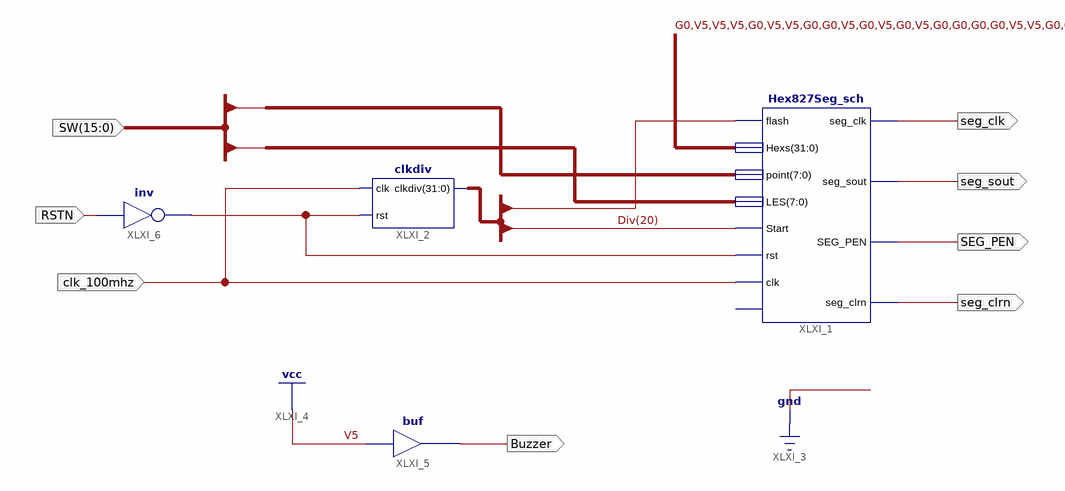
[diagram p0: schematic sheet 1]
// Xilinx ISE schematic Hex827_test.sch (kintex7) as structural Verilog: 4 symbols, 8 ports
module Hex827_test (
  input  clk_100mhz,
  input  RSTN,
  input  [15:0] SW,
  output Buzzer,
  output seg_clk,
  output seg_sout,
  output SEG_PEN,
  output seg_clrn
);

  wire XLXN_7;
  wire [31:0] Div;

  Hex827Seg_sch XLXI_1 (
    .flash(Div[25]), .Hexs(32'b01110110010101000011001000010000), .point(SW[7:0]), .LES(SW[15:8]),
    .Start(Div[20]), .rst(XLXN_7), .clk(clk_100mhz), .seg_clk(seg_clk), .seg_sout(seg_sout),
    .SEG_PEN(SEG_PEN), .seg_clrn(seg_clrn));  // open: SW0
  clkdiv XLXI_2 (.clkdiv(Div), .clk(clk_100mhz), .rst(XLXN_7));
  buf XLXI_5 (Buzzer, 1'b1);
  not XLXI_6 (XLXN_7, RSTN);
endmodule
